# Altium project 驱动板.PrjPCB
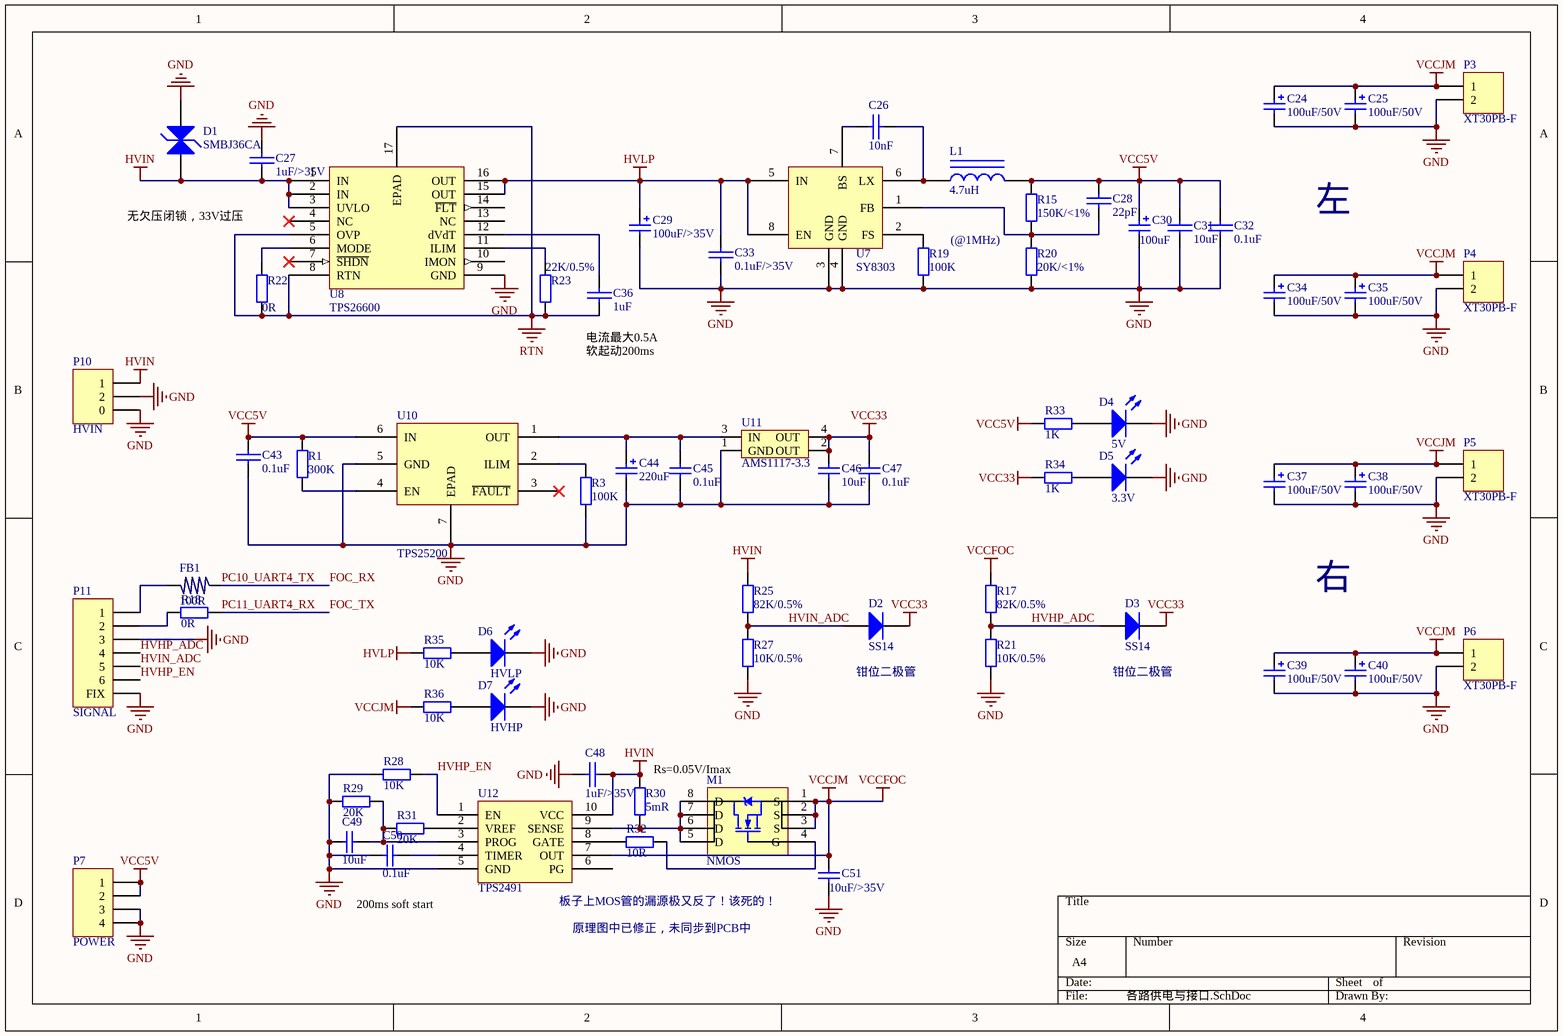
[diagram p0: 各路供电与接口.SchDoc]
3 sheets, 132 parts. Net scope: global (net labels, ports and power ports of the same name join across sheets).
Board file: 驱动板.PcbDoc
Sheets:
  各路供电与接口.SchDoc
  FOC主控M.SchDoc
  FOC功率.SchDoc

## Sheet 各路供电与接口.SchDoc
size A4

### Parts
C24  100uF/50V  [CS 6*6 - R]
C25  100uF/50V  [CS 6*6 - R]
C26  10nF  [C0805_M]
C27  1uF/>35V  [C0805_M]
C28  22pF  [C0805_M]
C29  100uF/>35V  [CS 6*6 - R]
C30  100uF  [CS 6*6 - R]
C31  10uF  [C0805_M]
C32  0.1uF  [C0805_M]
C33  0.1uF/>35V  [C0805_M]
C34  100uF/50V  [CS 6*6 - R]
C35  100uF/50V  [CS 6*6 - R]
C36  1uF  [C0805_M]
C37  100uF/50V  [CS 6*6 - R]
C38  100uF/50V  [CS 6*6 - R]
C39  100uF/50V  [CS 6*6 - R]
C40  100uF/50V  [CS 6*6 - R]
C43  0.1uF  [C0805_M]
C44  220uF  [CS 6*6 - R]
C45  0.1uF  [C0805_M]
C46  10uF  [C0805_M]
C47  0.1uF  [C0805_M]
C48  1uF/>35V  [C0805_M]
C49  10uF  [C0805_M]
C50  0.1uF  [C0805_M]
C51  10uF/>35V  [C0805_M]
D1  SMBJ36CA  [SMB]
D2  SS14  [SOD-323]
D3  SS14  [SOD-323]
D4  5V  [LED0805_G]
D5  3.3V  [LED0805_G]
D6  HVLP  [LED0805_G]
D7  HVHP  [LED0805_G]
FB1  100R  [R0805_M]
L1  4.7uH  [L-SMD-0630]
M1  NMOS  [DFN8L-5X6]
P3  XT30PB-F  [XT30PB-F]
P4  XT30PB-F  [XT30PB-F]
P5  XT30PB-F  [XT30PB-F]
P6  XT30PB-F  [XT30PB-F]
P7  POWER  [XH2.54-LI-4P]
P10  HVIN  [XT60PW-M]
P11  SIGNAL  [SH1.0-LT-6P]
R1  300K  [R0805_M]
R3  100K  [R0805_M]
R15  150K/<1%  [R0805_M]
R17  82K/0.5%  [R0805_M]
R18  0R  [R0805_M]
R19  100K  [R0805_M]
R20  20K/<1%  [R0805_M]
R21  10K/0.5%  [R0805_M]
R22  0R  [R0805_M]
R23  22K/0.5%  [R0805_M]
R25  82K/0.5%  [R0805_M]
R27  10K/0.5%  [R0805_M]
R28  10K  [R0805_M]
R29  20K  [R0805_M]
R30  5mR  [R2512_M]
R31  20K  [R0805_M]
R32  10R  [R0805_M]
R33  1K  [R0805_M]
R34  1K  [R0805_M]
R35  10K  [R0805_M]
R36  10K  [R0805_M]
U7  SY8303  [SOT23-8L]
U8  TPS26600  [ETSSOP16_M]
U10  TPS25200  [WSON-6]
U11  AMS1117-3.3  [SOT223_M]
U12  TPS2491  [VSSOP10]

### Nets
GND: C24.2 C25.2 C27.2 C29.2 C30.2 C31.1 C32.1 C33.1 C34.2 C35.2 C37.2 C38.2 C39.2 C40.2 C43.2 C44.2 C45.1 C46.1 C47.1 C48.1 C49.1 C50.1 C51.1 D1.1(A) D4.2(K) D5.2(K) D6.2(K) D7.2(K) P3.2 P4.2 P5.2 P6.2 P7.3 P7.4 P10.0 P10.2 P11.0(FIX) P11.3 R3.1 R19.2 R20.2 R21.2 R27.2 R28.2 R29.2 U7.3(GND) U7.4(GND) U8.9(GND) U10.5(GND) U10.7(EPAD) U11.1(GND) U12.5(GND)
HVIN: C27.1 C48.2 D1.2(K) P10.1 R25.1 R30.2 U8.1(IN) U8.2(IN) U8.3(UVLO) U12.10(VCC)
HVLP: C29.1 C33.2 R35.2 U7.5(IN) U7.8(EN) U8.15(OUT) U8.16(OUT)
RTN: C36.2 R22.2 R23.2 U8.5(OVP) U8.8(RTN) U8.17(EPAD)
VCC5V: C28.2 C30.1 C31.2 C32.2 C43.1 L1.2 P7.1 P7.2 R1.2 R15.1 R33.2 U10.6(IN)
VCC33: C46.2 C47.2 D2.2(K) D3.2(K) R34.2 U11.2(OUT) U11.4(OUT)
VCCFOC: C24.1 C25.1 C34.1 C35.1 C37.1 C38.1 C39.1 C40.1 C51.2 M1.1(S) M1.2(S) M1.3(S) P3.1 P4.1 P5.1 P6.1 R17.1 R36.2 U12.7(OUT)  [also labelled VCCJM]
FOC_RX: FB1.1  [also labelled PC10_UART4_TX]
FOC_TX: R18.1  [also labelled PC11_UART4_RX]
HVHP_ADC: D3.1(A) P11.4 R17.2 R21.1
HVHP_EN: P11.6 R28.1 U12.1(EN)
HVIN_ADC: D2.1(A) P11.5 R25.2 R27.1
NetC26_1: C26.1 U7.7(BS)
NetC26_2: C26.2 L1.1 U7.6(LX)
NetC28_1: C28.1 R15.2 R20.1 U7.1(FB)
NetC36_1: C36.1 U8.12(dVdT)
NetC44_1: C44.1 C45.2 U10.1(OUT) U11.3(IN)
NetC49_2: C49.2 R29.1 R31.2 U12.3(PROG)
NetC50_2: C50.2 U12.4(TIMER)
NetD4_1: D4.1(A) R33.1
NetD5_1: D5.1(A) R34.1
NetD6_1: D6.1(A) R35.1
NetD7_1: D7.1(A) R36.1
NetFB1_2: FB1.2 P11.1
NetM1_4: M1.4(G) R32.1
NetM1_5: M1.5(D) M1.6(D) M1.7(D) M1.8(D) R30.1 U12.9(SENSE)
NetP11_2: P11.2 R18.2
NetR1_1: R1.1 U10.4(EN)
NetR3_2: R3.2 U10.2(ILIM)
NetR19_1: R19.1 U7.2(FS)
NetR22_1: R22.1 U8.6(MODE)
NetR23_1: R23.1 U8.11(ILIM)
NetR31_1: R31.1 U12.2(VREF)
NetR32_2: R32.2 U12.8(GATE)

Not connected (* = marked no-connect by the designer): U8 4(NC)* 7(~{SHDN})* 10(IMON) 13(NC) 14(~{FLT}); U10 3(~{FAULT})*; U12 6(PG)

### Notes on the sheet
- 无欠压闭锁，33V过压
- (@1MHz)
- 左
- (near C36) 电流最大0.5A
  软起动200ms
- 右
- (near D2) 钳位二极管
- (near D3) 钳位二极管
- Rs=0.05V/Imax
- 200ms soft start
- (near U12) 板子上MOS管的漏源极又反了！该死的！
- 原理图中已修正，未同步到PCB中

### Library data of the parts
C24 C25 C34 C35 C37-C40 = Cap Pol2: Low ESR required; Published: 8-Jun-2000; LatestRevisionDate: 17-Jul-2002; LatestRevisionNote: Re-released for DXP Platform.; PackageReference: POLAR0.8; Publisher: Altium Limited; PackageDescription: Polarized Capacitor; 2 Leads
C26-C28 C31-C33 C36 C43 C48 = CAP: Capacitor
C29 C30 = Cap Pol2: 固态电容; Published: 8-Jun-2000; LatestRevisionDate: 17-Jul-2002; LatestRevisionNote: Re-released for DXP Platform.; PackageReference: POLAR0.8; Publisher: Altium Limited; PackageDescription: Polarized Capacitor; 2 Leads
C44 = Cap Pol2: Polarized Capacitor (Axial); Value: 100pF; Published: 8-Jun-2000; LatestRevisionDate: 17-Jul-2002; LatestRevisionNote: Re-released for DXP Platform.; PackageReference: POLAR0.8; Publisher: Altium Limited; PackageDescription: Polarized Capacitor; 2 Leads
C45-C47 C49 C50 = Cap: Capacitor; Value: 100pF; Published: 8-Jun-2000; LatestRevisionDate: 17-Jul-2002; LatestRevisionNote: Re-released for DXP Platform.; PackageReference: RAD-0.3; Publisher: Altium Limited; PackageDescription: Radial Cap, Thru-Hole; 2 Leads; 0.3 in Pin Spacing
C51 = Cap: Capacitor; Published: 8-Jun-2000; LatestRevisionDate: 17-Jul-2002; LatestRevisionNote: Re-released for DXP Platform.; PackageReference: RAD-0.3; Publisher: Altium Limited; PackageDescription: Radial Cap, Thru-Hole; 2 Leads; 0.3 in Pin Spacing
D1 = TVS
D2 D3 = Diode: Default Diode; Published: 8-Jun-2000; LatestRevisionDate: 17-Jul-2002; LatestRevisionNote: Re-released for DXP Platform.; PackageVersion: Sep-1996; PackageReference: SMC; Publisher: Altium Limited; PackageDescription: DO-214-AB/SMC; 2 C-Bend Leads; Body 7.9 x 5.9 mm, inc. leads (LxW); Code_JEDEC: DO-214-AB
D4-D7 = LED1: Typical RED GaAs LED; Published: 8-Jun-2000; LatestRevisionDate: 08-Jul-2005; LatestRevisionNote: Mech Layer 1 removed.; PackageReference: LED-1; Publisher: Altium Limited; PackageDescription: LED; 2 Leads
FB1 = L
L1 = Inductor Iron: Magnetic-Core Inductor; Value: 10mH; Published: 24-Mar-1999; LatestRevisionDate: 17-Jul-2002; LatestRevisionNote: Re-released for DXP Platform.; PackageReference: AXIAL-0.9; Publisher: Altium Limited; PackageDescription: Axial Device, Thru-Hole; 2 Leads; 0.9 in Pin Spacing
M1 = NMOS_IC
P3-P6 = Header 2: Header, 2-Pin; LatestRevisionDate: 17-Jul-2002; LatestRevisionNote: Re-released for DXP Platform.; Publisher: Altium Limited
P7 = Header 4: Header, 4-Pin; LatestRevisionDate: 17-Jul-2002; LatestRevisionNote: Re-released for DXP Platform.; Publisher: Altium Limited
P10 = Header 3: Header, 3-Pin; LatestRevisionDate: 17-Jul-2002; LatestRevisionNote: Re-released for DXP Platform.; Publisher: Altium Limited
P11 = Header 7: Header, 7-Pin; LatestRevisionDate: 17-Jul-2002; LatestRevisionNote: Re-released for DXP Platform.; Publisher: Altium Limited
R1 R3 R15 R17-R23 R25 R27-R32 R35 R36 = Res2: Resistor; Value: 1K; Published: 8-Jun-2000; LatestRevisionDate: 17-Jul-2002; LatestRevisionNote: Re-released for DXP Platform.; PackageReference: AXIAL-0.4; Publisher: Altium Limited; PackageDescription: Axial Device, Thru-Hole; 2 Leads; 0.4 in Pin Spacing
R33 R34 = Res2: Resistor; Published: 8-Jun-2000; LatestRevisionDate: 17-Jul-2002; LatestRevisionNote: Re-released for DXP Platform.; PackageReference: AXIAL-0.4; Publisher: Altium Limited; PackageDescription: Axial Device, Thru-Hole; 2 Leads; 0.4 in Pin Spacing; Value: 1K
U11 = AMS1117

## Sheet FOC主控M.SchDoc
size A4
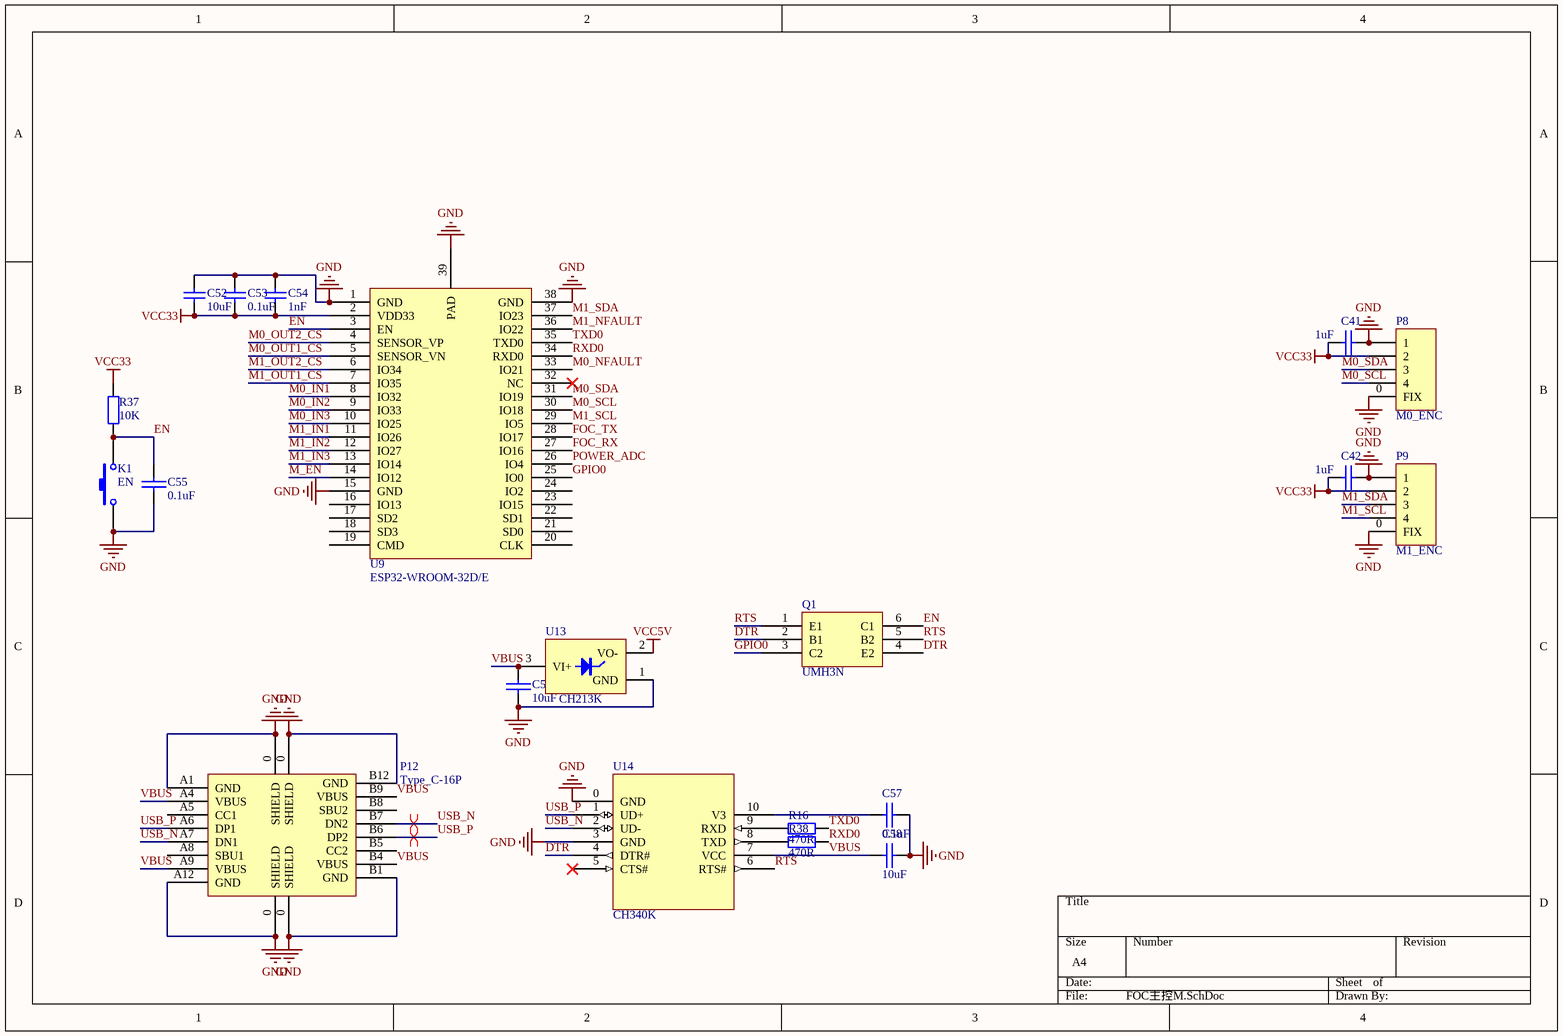
[diagram p1: FOC主控M.SchDoc]

### Parts
C41  1uF  [C0805_M]
C42  1uF  [C0805_M]
C52  10uF  [C0805_M]
C53  0.1uF  [C0805_M]
C54  1nF  [C0805_M]
C55  0.1uF  [C0805_M]
C56  10uF  [C0805_M]
C57  0.1uF  [C0805_M]
C58  10uF  [C0805_M]
K1  EN  [SW_SMT]
P8  M0_ENC  [SH1.0-WT-4P]
P9  M1_ENC  [SH1.0-WT-4P]
P12  Type_C-16P  [USB-C-SMD_16P]
Q1  UMH3N  [SOT363_M]
R16  470R  [R0805_M]
R37  10K  [R0805_M]
R38  470R  [R0805_M]
U9  ESP32-WROOM-32D/E  [ESP32-WROOM-32D/E]
U13  CH213K  [SOT-23-3]
U14  CH340K  [ESSOP10]

### Nets
GND: C41.2 C42.2 C52.2 C53.2 C54.2 C55.1 C56.1 C57.1 C58.1 K1.1 P8.0(FIX) P8.1 P9.0(FIX) P9.1 P12.0(SHIELD) P12.A1(GND) P12.A12(GND) P12.B1(GND) P12.B12(GND) U9.1(GND) U9.15(GND) U9.38(GND) U9.39(PAD) U13.1(GND) U14.0(GND) U14.3(GND)
VCC5V: U13.2(VO-)
VCC33: C41.1 C42.1 C52.1 C53.1 C54.1 P8.2 P9.2 R37.1 U9.2(VDD33)
DTR: Q1.2(B1) Q1.4(E2) U14.4(DTR#)
EN: C55.2 K1.2 Q1.6(C1) R37.2 U9.3(EN)
FOC_RX: U9.27(IO16)
FOC_TX: U9.28(IO17)
GPIO0: Q1.3(C2) U9.25(IO0)
M0_IN1: U9.8(IO32)
M0_IN2: U9.9(IO33)
M0_IN3: U9.10(IO25)
M0_NFAULT: U9.33(IO21)
M0_OUT1_CS: U9.5(SENSOR_VN)
M0_OUT2_CS: U9.4(SENSOR_VP)
M0_SCL: P8.4 U9.30(IO18)
M0_SDA: P8.3 U9.31(IO19)
M1_IN1: U9.11(IO26)
M1_IN2: U9.12(IO27)
M1_IN3: U9.13(IO14)
M1_NFAULT: U9.36(IO22)
M1_OUT1_CS: U9.7(IO35)
M1_OUT2_CS: U9.6(IO34)
M1_SCL: P9.4 U9.29(IO5)
M1_SDA: P9.3 U9.37(IO23)
M_EN: U9.14(IO12)
POWER_ADC: U9.26(IO4)
RTS: Q1.1(E1) Q1.5(B2) U14.6(RTS#)
RXD0: R38.2 U9.34(RXD0)
TXD0: R16.2 U9.35(TXD0)
USB_N: P12.A7(DN1) P12.B7(DN2) U14.2(UD-)
USB_P: P12.A6(DP1) P12.B6(DP2) U14.1(UD+)
VBUS: C56.2 C58.2 P12.A4(VBUS) P12.A9(VBUS) P12.B4(VBUS) P12.B9(VBUS) U13.3(VI+) U14.7(VCC)
NetC57_2: C57.2 U14.10(V3)
NetR16_1: R16.1 U14.9(RXD)
NetR38_1: R38.1 U14.8(TXD)

Not connected (* = marked no-connect by the designer): P12 A5(CC1) A8(SBU1) B5(CC2) B8(SBU2); U9 16(IO13) 17(SD2) 18(SD3) 19(CMD) 20(CLK) 21(SD0) 22(SD1) 23(IO15) 24(IO2) 32(NC)*; U14 5(CTS#)*

### Layout directives
differential pair: USB_N, USB_P

### Library data of the parts
C41 C42 C55-C58 = CAP: Capacitor
C52-C54 = Cap: Capacitor; Value: 100pF; Published: 8-Jun-2000; LatestRevisionDate: 17-Jul-2002; LatestRevisionNote: Re-released for DXP Platform.; PackageReference: RAD-0.3; Publisher: Altium Limited; PackageDescription: Radial Cap, Thru-Hole; 2 Leads; 0.3 in Pin Spacing
K1 = SW-PB: Switch; Published: 24-Mar-1999; LatestRevisionDate: 17-Jul-2002; LatestRevisionNote: Re-released for DXP Platform.; PackageReference: SPST-2; Publisher: Altium Limited; PackageDescription: Switch; 2 Leads
P8 P9 = Header 5: LatestRevisionDate: 17-Jul-2002; LatestRevisionNote: Re-released for DXP Platform.; Publisher: Altium Limited
Q1 = D2NPN: 数字晶体管（带电阻）
R16 R37 R38 = Res2: Resistor; Value: 1K; Published: 8-Jun-2000; LatestRevisionDate: 17-Jul-2002; LatestRevisionNote: Re-released for DXP Platform.; PackageReference: AXIAL-0.4; Publisher: Altium Limited; PackageDescription: Axial Device, Thru-Hole; 2 Leads; 0.4 in Pin Spacing
U13 = CH213K: Ideal Diode 5V*1A
U14 = CH340K: USB to TTL Serial / UART for dual power

## Sheet FOC功率.SchDoc
size A4
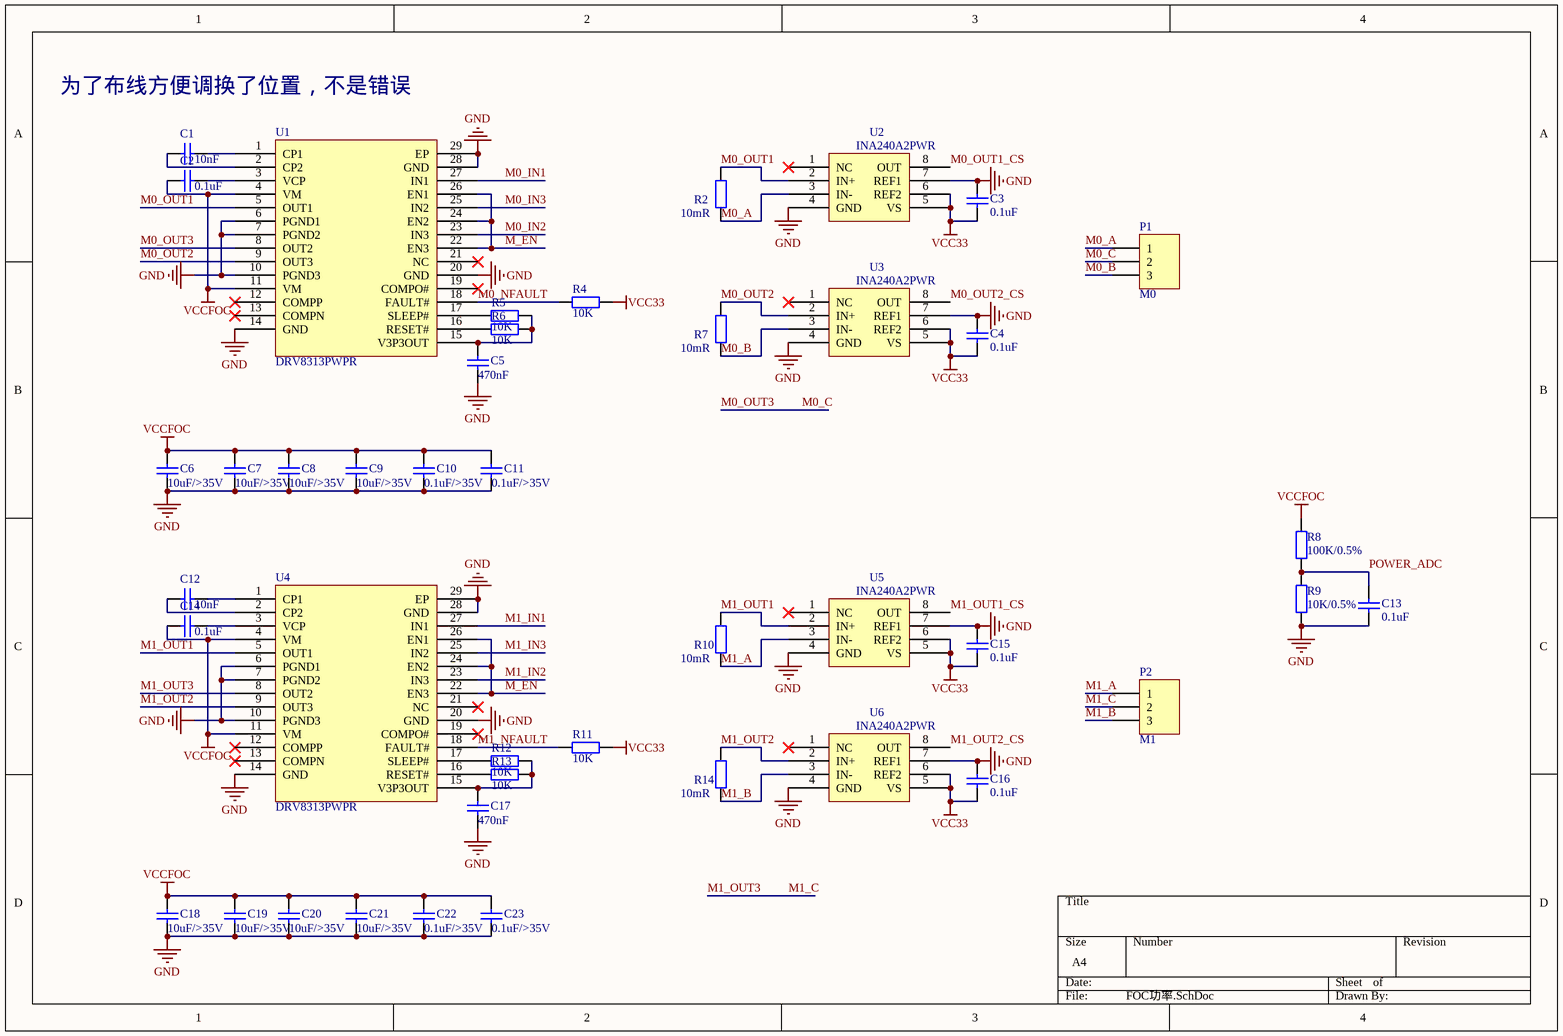
[diagram p2: FOC功率.SchDoc]

### Parts
C1  10nF  [C0805_M]
C2  0.1uF  [C0805_M]
C3  0.1uF  [C0805_M]
C4  0.1uF  [C0805_M]
C5  470nF  [C0805_M]
C6  10uF/>35V  [C0805_M]
C7  10uF/>35V  [C0805_M]
C8  10uF/>35V  [C0805_M]
C9  10uF/>35V  [C0805_M]
C10  0.1uF/>35V  [C0805_M]
C11  0.1uF/>35V  [C0805_M]
C12  10nF  [C0805_M]
C13  0.1uF  [C0805_M]
C14  0.1uF  [C0805_M]
C15  0.1uF  [C0805_M]
C16  0.1uF  [C0805_M]
C17  470nF  [C0805_M]
C18  10uF/>35V  [C0805_M]
C19  10uF/>35V  [C0805_M]
C20  10uF/>35V  [C0805_M]
C21  10uF/>35V  [C0805_M]
C22  0.1uF/>35V  [C0805_M]
C23  0.1uF/>35V  [C0805_M]
P1  M0  [MR30PB-F]
P2  M1  [MR30PB-F]
R2  10mR  [R1206_M]
R4  10K  [R0805_M]
R5  10K  [R0805_M]
R6  10K  [R0805_M]
R7  10mR  [R1206_M]
R8  100K/0.5%  [R0805_M]
R9  10K/0.5%  [R0805_M]
R10  10mR  [R1206_M]
R11  10K  [R0805_M]
R12  10K  [R0805_M]
R13  10K  [R0805_M]
R14  10mR  [R1206_M]
U1  DRV8313PWPR  [TSSOP28-PowerPad]
U2  INA240A2PWR  [TSSOP8]
U3  INA240A2PWR  [TSSOP8]
U4  DRV8313PWPR  [TSSOP28-PowerPad]
U5  INA240A2PWR  [TSSOP8]
U6  INA240A2PWR  [TSSOP8]

### Nets
GND: C3.2 C4.2 C5.1 C6.1 C7.1 C8.1 C9.1 C10.1 C11.1 C13.1 C15.2 C16.2 C17.1 C18.1 C19.1 C20.1 C21.1 C22.1 C23.1 R9.2 U1.6(PGND1) U1.7(PGND2) U1.10(PGND3) U1.14(GND) U1.20(GND) U1.28(GND) U1.29(EP) U2.4(GND) U2.7(REF1) U3.4(GND) U3.7(REF1) U4.6(PGND1) U4.7(PGND2) U4.10(PGND3) U4.14(GND) U4.20(GND) U4.28(GND) U4.29(EP) U5.4(GND) U5.7(REF1) U6.4(GND) U6.7(REF1)
VCC33: C3.1 C4.1 C15.1 C16.1 R4.2 R11.2 U2.5(VS) U2.6(REF2) U3.5(VS) U3.6(REF2) U5.5(VS) U5.6(REF2) U6.5(VS) U6.6(REF2)
VCCFOC: C2.1 C6.2 C7.2 C8.2 C9.2 C10.2 C11.2 C14.1 C18.2 C19.2 C20.2 C21.2 C22.2 C23.2 R8.1 U1.4(VM) U1.11(VM) U4.4(VM) U4.11(VM)
M0_A: P1.1 R2.1 U2.3(IN-)
M0_B: P1.3 R7.1 U3.3(IN-)
M0_C: P1.2 U1.8(OUT2)  [also labelled M0_OUT3]
M0_IN1: U1.27(IN1)
M0_IN2: U1.23(IN3)
M0_IN3: U1.25(IN2)
M0_NFAULT: R4.1 U1.18(FAULT#)
M0_OUT1: R2.2 U1.5(OUT1) U2.2(IN+)
M0_OUT1_CS: U2.8(OUT)
M0_OUT2: R7.2 U1.9(OUT3) U3.2(IN+)
M0_OUT2_CS: U3.8(OUT)
M1_A: P2.1 R10.1 U5.3(IN-)
M1_B: P2.3 R14.1 U6.3(IN-)
M1_C: P2.2 U4.8(OUT2)  [also labelled M1_OUT3]
M1_IN1: U4.27(IN1)
M1_IN2: U4.23(IN3)
M1_IN3: U4.25(IN2)
M1_NFAULT: R11.1 U4.18(FAULT#)
M1_OUT1: R10.2 U4.5(OUT1) U5.2(IN+)
M1_OUT1_CS: U5.8(OUT)
M1_OUT2: R14.2 U4.9(OUT3) U6.2(IN+)
M1_OUT2_CS: U6.8(OUT)
M_EN: U1.22(EN3) U1.24(EN2) U1.26(EN1) U4.22(EN3) U4.24(EN2) U4.26(EN1)
POWER_ADC: C13.2 R8.2 R9.1
NetC1_1: C1.1 U1.2(CP2)
NetC1_2: C1.2 U1.1(CP1)
NetC2_2: C2.2 U1.3(VCP)
NetC5_2: C5.2 R5.2 R6.2 U1.15(V3P3OUT)
NetC12_1: C12.1 U4.2(CP2)
NetC12_2: C12.2 U4.1(CP1)
NetC14_2: C14.2 U4.3(VCP)
NetC17_2: C17.2 R12.2 R13.2 U4.15(V3P3OUT)
NetR5_1: R5.1 U1.17(SLEEP#)
NetR6_1: R6.1 U1.16(RESET#)
NetR12_1: R12.1 U4.17(SLEEP#)
NetR13_1: R13.1 U4.16(RESET#)

Not connected (* = marked no-connect by the designer): U1 12(COMPP)* 13(COMPN)* 19(COMPO#)* 21(NC)*; U2 1(NC)*; U3 1(NC)*; U4 12(COMPP)* 13(COMPN)* 19(COMPO#)* 21(NC)*; U5 1(NC)*; U6 1(NC)*

### Notes on the sheet
- 为了布线方便调换了位置，不是错误

### Library data of the parts
C1-C23 = Cap: Capacitor; Published: 8-Jun-2000; LatestRevisionDate: 17-Jul-2002; LatestRevisionNote: Re-released for DXP Platform.; PackageReference: RAD-0.3; Publisher: Altium Limited; PackageDescription: Radial Cap, Thru-Hole; 2 Leads; 0.3 in Pin Spacing
P1 P2 = Header 3: Header, 3-Pin; LatestRevisionDate: 17-Jul-2002; LatestRevisionNote: Re-released for DXP Platform.; Publisher: Altium Limited
R2 R7 R10 R14 = Res2: Resistor; Published: 8-Jun-2000; LatestRevisionDate: 17-Jul-2002; LatestRevisionNote: Re-released for DXP Platform.; PackageReference: AXIAL-0.4; Publisher: Altium Limited; PackageDescription: Axial Device, Thru-Hole; 2 Leads; 0.4 in Pin Spacing
R4-R6 R8 R9 R11-R13 = Res2: Resistor; Value: 1K; Published: 8-Jun-2000; LatestRevisionDate: 17-Jul-2002; LatestRevisionNote: Re-released for DXP Platform.; PackageReference: AXIAL-0.4; Publisher: Altium Limited; PackageDescription: Axial Device, Thru-Hole; 2 Leads; 0.4 in Pin Spacing
U2 U3 U5 U6 = Component_3

## Nets that join several sheets
GND: 各路供电与接口 (52 pins), FOC主控M (26 pins), FOC功率 (42 pins)
VCC5V: 各路供电与接口 (12 pins), FOC主控M (U13.2)
VCC33: 各路供电与接口 (7 pins), FOC主控M (9 pins), FOC功率 (14 pins)
VCCFOC: 各路供电与接口 (19 pins), FOC功率 (19 pins)
FOC_RX: 各路供电与接口 (FB1.1), FOC主控M (U9.27)
FOC_TX: 各路供电与接口 (R18.1), FOC主控M (U9.28)
M0_IN1: FOC主控M (U9.8), FOC功率 (U1.27)
M0_IN2: FOC主控M (U9.9), FOC功率 (U1.23)
M0_IN3: FOC主控M (U9.10), FOC功率 (U1.25)
M0_NFAULT: FOC主控M (U9.33), FOC功率 (R4.1 U1.18)
M0_OUT1_CS: FOC主控M (U9.5), FOC功率 (U2.8)
M0_OUT2_CS: FOC主控M (U9.4), FOC功率 (U3.8)
M1_IN1: FOC主控M (U9.11), FOC功率 (U4.27)
M1_IN2: FOC主控M (U9.12), FOC功率 (U4.23)
M1_IN3: FOC主控M (U9.13), FOC功率 (U4.25)
M1_NFAULT: FOC主控M (U9.36), FOC功率 (R11.1 U4.18)
M1_OUT1_CS: FOC主控M (U9.7), FOC功率 (U5.8)
M1_OUT2_CS: FOC主控M (U9.6), FOC功率 (U6.8)
M_EN: FOC主控M (U9.14), FOC功率 (6 pins)
POWER_ADC: FOC主控M (U9.26), FOC功率 (C13.2 R8.2 R9.1)